# Altium project rotary-led-ring.PrjPcb
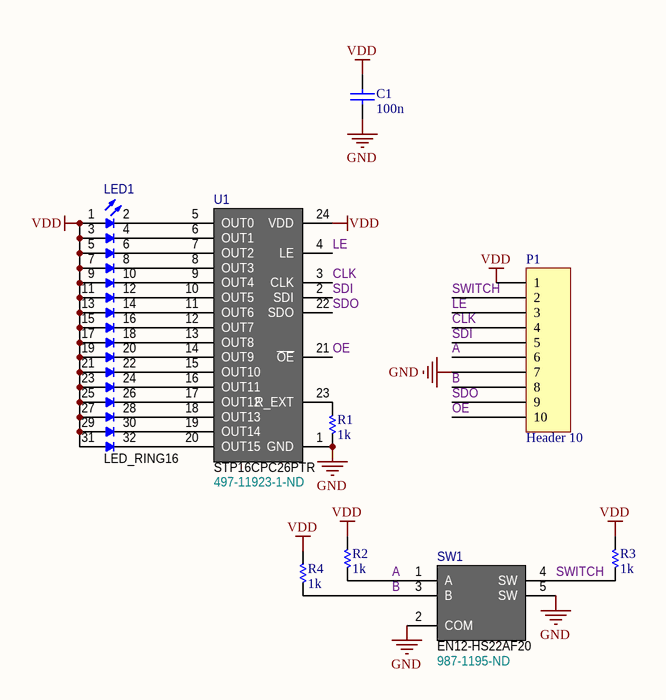
[diagram p0: rotary-led-ring.SchDoc]
1 sheet, 9 parts. Net scope: global (net labels, ports and power ports of the same name join across sheets).
Board file: rotary-led-ring.PcbDoc

## Sheet rotary-led-ring.SchDoc
size Letter

### Parts
C1  100n  [CAPC1608N]
LED1  LED_RING16  [LEDRING_16_GREEN]
P1  Header 10  [HDR1X10]
R1  1k  [RESC1608N]
R2  1k  [RESC1608N]
R3  1k  [RESC1608N]
R4  1k  [RESC1608N]
SW1  EN12-HS22AF20  Supplier Part Number 1: 987-1195-ND  [EN12-HS]
U1  STP16CPC26PTR  Supplier Part Number 1: 497-11923-1-ND  [SOP635P600-24N]

### Nets
GND: C1.1 P1.7 R1.2 SW1.2(COM) SW1.5(SW) U1.1(GND)
VDD: C1.2 LED1.1(A) LED1.3(A) LED1.5(A) LED1.7(A) LED1.9(A) LED1.11(A) LED1.13(A) LED1.15(A) LED1.17(A) LED1.19(A) LED1.21(A) LED1.23(A) LED1.25(A) LED1.27(A) LED1.29(A) LED1.31(A) P1.1 R2.1 R3.1 R4.1 U1.24(VDD)
A: P1.6 R2.2 SW1.1(A)
B: P1.8 R4.2 SW1.3(B)
CLK: P1.4 U1.3(CLK)
LE: P1.3 U1.4(LE)
OE: P1.10 U1.21(~{OE})
SDI: P1.5 U1.2(SDI)
SDO: P1.9 U1.22(SDO)
SWITCH: P1.2 R3.2 SW1.4(SW)
NetLED1_2: LED1.2(K) U1.5(OUT0)
NetLED1_4: LED1.4(K) U1.6(OUT1)
NetLED1_6: LED1.6(K) U1.7(OUT2)
NetLED1_8: LED1.8(K) U1.8(OUT3)
NetLED1_10: LED1.10(K) U1.9(OUT4)
NetLED1_12: LED1.12(K) U1.10(OUT5)
NetLED1_14: LED1.14(K) U1.11(OUT6)
NetLED1_16: LED1.16(K) U1.12(OUT7)
NetLED1_18: LED1.18(K) U1.13(OUT8)
NetLED1_20: LED1.20(K) U1.14(OUT9)
NetLED1_22: LED1.22(K) U1.15(OUT10)
NetLED1_24: LED1.24(K) U1.16(OUT11)
NetLED1_26: LED1.26(K) U1.17(OUT12)
NetLED1_28: LED1.28(K) U1.18(OUT13)
NetLED1_30: LED1.30(K) U1.19(OUT14)
NetLED1_32: LED1.32(K) U1.20(OUT15)
NetR1_1: R1.1 U1.23(R_EXT)

### Library data of the parts
C1 = Cap Semi: Capacitor (Semiconductor SIM Model); Published: 8-Jun-2000; LatestRevisionDate: 29-May-2009; LatestRevisionNote: IPC-7351 Footprint Added.; PackageReference: C1206; Publisher: Altium Limited; PackageDescription: Chip Capacitor
P1 = Header 10: Header, 10-Pin; LatestRevisionDate: 17-Jul-2002; LatestRevisionNote: Re-released for DXP Platform.; Publisher: Altium Limited
R1-R4 = Res Semi: Semiconductor Resistor; Published: 8-Jun-2000; LatestRevisionDate: 17-Jul-2002; LatestRevisionNote: Re-released for DXP Platform.; PackageReference: AXIAL-0.5; Publisher: Altium Limited; PackageDescription: Axial Device, Thru-Hole; 2 Leads; 0.5 in Pin Spacing
SW1 = EN12-HS22AF20: ENCODER 12MM ROTARY SW TOP ADJ; Manufacturer: TT Electronics/BI; Encoder Type: Mechanical; Output Type: Quadrature (Incremental); Pulses per Revolution: 24; Actuator Type: 6mm Dia Flatted End; Detent: Yes; Rotational Life (Cycles Min): 30K; Supplier 1: Digi-Key; Manufacturer Part Number: EN12-HS22AF20; RoHS: RoHS Compliant; Category: Sensors, Transducers; Stock 1: 5812; Pricing 1: 1=1.07, 10=0.999, 25=0.9436, 50=0.8326, 100=0.6845, 250=0.666, 500=0.629, 1000=0.592, 5000=0.518 (USD); Part Status: Active; Voltage - Supply: -; Built in Switch: Yes; Mounting Type: PCB, Through Hole; Orientation: Vertical; Termination Style: PC Pin; ComponentLink1URL: http://www.bitechnologies.com/pdfs/en12.pdf; ComponentLink1Description: http://www.bitechnologies.com/pdfs/en12.pdf
U1 = STP16CPC26PTR: IC LED DRVR LIN DIM 90MA 24QSOP; Manufacturer: STMicroelectronics; Topology: Shift Register; Internal Switch(s): Yes; Number of Outputs: 16; Voltage - Supply (Min): 3V; Voltage - Supply (Max): 5.5V; Voltage - Output: 20V; Frequency: 30MHz; Dimming: Analog; Supplier 1: Digi-Key; Manufacturer Part Number: STP16CPC26PTR; RoHS: RoHS Compliant; Category: Integrated Circuits (ICs); Stock 1: 0; Pricing 1: 1=0 (USD); Packaging: Cut Tape (CT); Part Status: Discontinued; Type: Linear; Current - Output / Channel: 90mA; Applications: Lighting; Operating Temperature: -40°C ~ 125°C (TA); Mounting Type: Surface Mount; Package / Case: 24-SSOP (0.154", 3.90mm Width); Supplier Device Package: 24-QSOP; ComponentLink1URL: http://www.st.com/content/ccc/resource/technical/document/datasheet/5c/ed/b3/8b/32/99/4d/cd/CD00298756.pdf/files/CD00298756.pdf/jcr:content/translations/en.CD00298756.pdf; ComponentLink1Description: http://www.st.com/content/ccc/resource/technical/document/datasheet/5c/ed/b3/8b/32/99/4d/cd/CD00298756.pdf/files/CD00298756.pdf/jcr:content/translations/en.CD00298756.pdf